# EAGLE schematic esp12_led_improved (EAGLE 7.7.0)
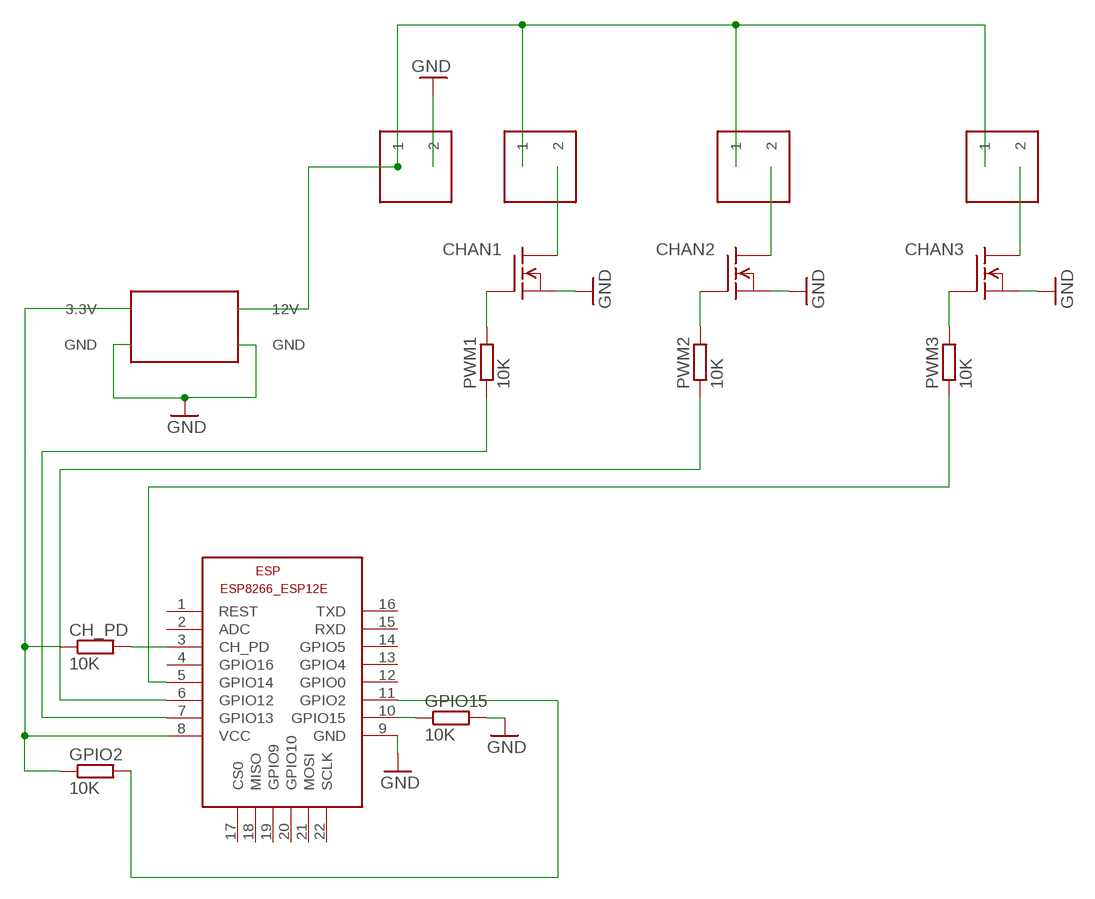
[diagram p0: schematic, sheet 1]

## Parts
CH_PD  10K  R-EU_R0603  [R0603]
CHAN1  FDS5680  [SO-8]
CHAN2  FDS5680  [SO-8]
CHAN3  FDS5680  [SO-8]
ESP  ESP8266-12EESP8266-ESP12E  [ESP8266-ESP12E]
GPIO2  10K  R-EU_R0603  [R0603]
GPIO15  10K  R-EU_R0603  [R0603]
OUT1  KF350-P2  [KF350-2P]
OUT2  KF350-P2  [KF350-2P]
OUT3  KF350-P2  [KF350-2P]
PWM1  10K  R-EU_R0603  [R0603]
PWM2  10K  R-EU_R0603  [R0603]
PWM3  10K  R-EU_R0603  [R0603]
PWR1  MP2307-MINI-360  [MP2307-MINI-360]
PWR_IN  KF350-P2  [KF350-2P]

## Nets
3.3V: CH_PD.1 ESP.8(VCC) GPIO2.1 PWR1.3.3V
12V: OUT1.1 OUT2.1 OUT3.1 PWR1.12V PWR_IN.1
GND: CHAN1.1(S) CHAN1.2(S) CHAN1.3(S) CHAN2.1(S) CHAN2.2(S) CHAN2.3(S) CHAN3.1(S) CHAN3.2(S) CHAN3.3(S) ESP.9(GND) GPIO15.2 PWR1.GND@1(GND) PWR1.GND@2(GND) PWR_IN.2
N$1: CHAN1.5(D) CHAN1.6(D) CHAN1.7(D) CHAN1.8(D) OUT1.2
N$2: ESP.10(GPIO15) GPIO15.1
N$3: CH_PD.2 ESP.3(CH_PD)
N$4: ESP.11(GPIO2) GPIO2.2
N$5: CHAN1.4(G) PWM1.2
N$6: ESP.7(GPIO13) PWM1.1
N$7: CHAN2.5(D) CHAN2.6(D) CHAN2.7(D) CHAN2.8(D) OUT2.2
N$8: CHAN2.4(G) PWM2.2
N$9: CHAN3.5(D) CHAN3.6(D) CHAN3.7(D) CHAN3.8(D) OUT3.2
N$10: CHAN3.4(G) PWM3.2
N$11: ESP.6(GPIO12) PWM2.1
N$12: ESP.5(GPIO14) PWM3.1
Unconnected: ESP.1(REST) ESP.2(ADC) ESP.4(GPIO16) ESP.12(GPIO0) ESP.13(GPIO4) ESP.14(GPIO5) ESP.15(RXD) ESP.16(TXD) ESP.17(CS0) ESP.18(MISO) ESP.19(GPIO9) ESP.20(GPIO10) ESP.21(MOSI) ESP.22(SCLK)

## Library data of the parts
CH_PD GPIO2 GPIO15 PWM1-PWM3 = resistor:R-EU_: RESISTOR, European symbol
CHAN1-CHAN3 = transistor-fet:FDS5680: 60V N-Channel PowerTrench TM MOSFET FAIRCHILD FDS5680.pdf
ESP = ESP8266-ESP12E:ESP8266-12E: ESP8266-12E with additional I/O and GPIO04/05 corrected The author cannot warrant that this library is free from error or will meet your specific requirements. Created by PuceBaboon.com. Komagane, Nagano, JAPAN
OUT1-OUT3 PWR_IN = KF350-P2:KF350-P2
PWR1 = MP2307-MINI-360:MP2307-MINI-360